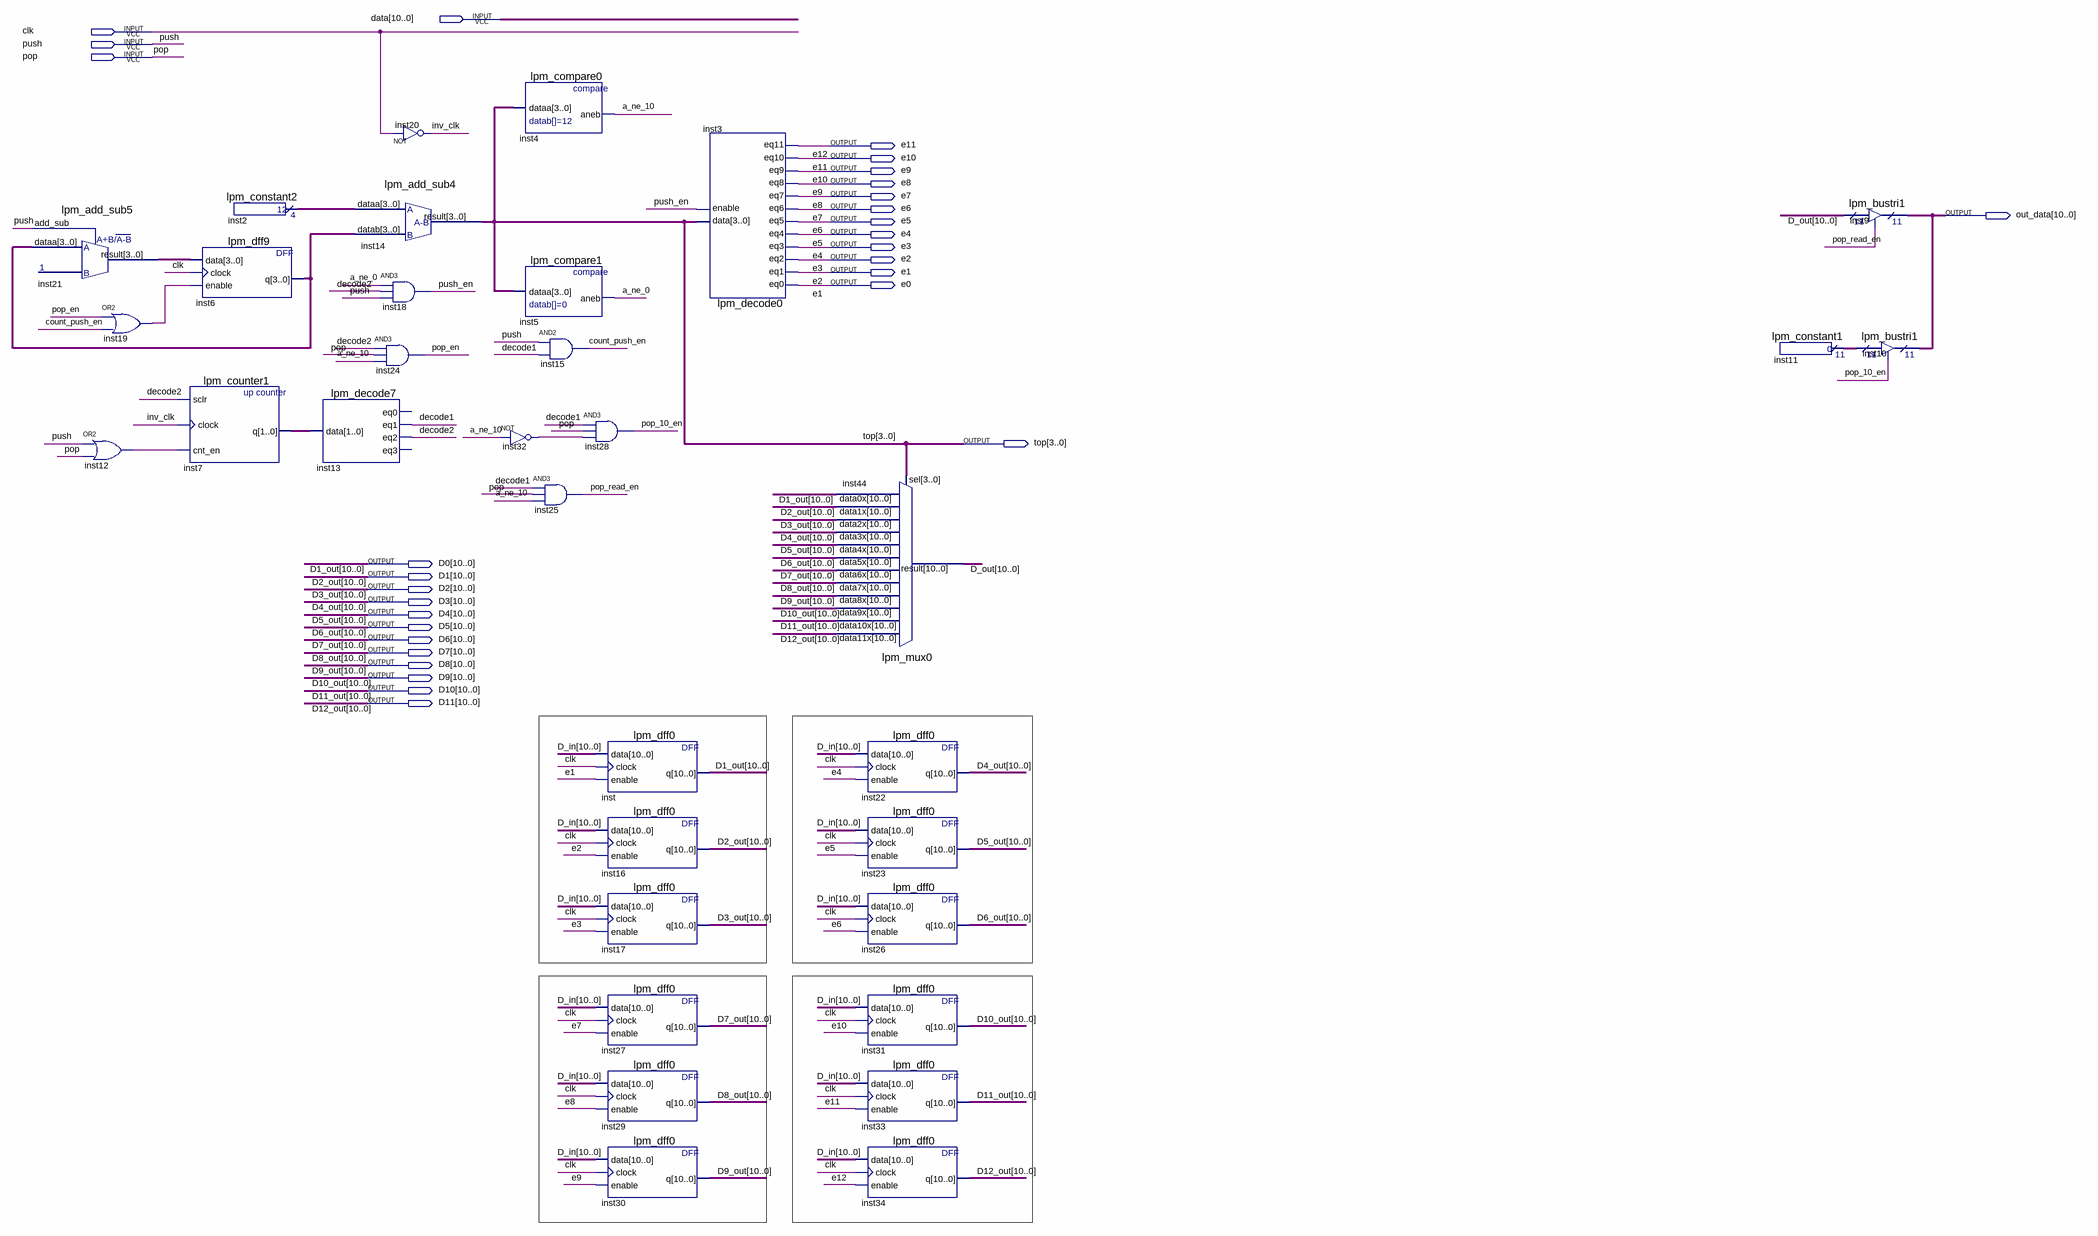
[diagram p0: schematic sheet]
// Quartus schematic STACK.bdf as structural Verilog: 34 symbols, 30 pins
module STACK (
  input  [10:0] data,
  input  clk,
  input  push,
  input  pop,
  output e11,
  output e10,
  output e9,
  output e8,
  output e7,
  output e6,
  output [10:0] out_data,
  output e5,
  output e4,
  output e3,
  output e2,
  output e1,
  output e0,
  output [3:0] top,
  output [10:0] D0,
  output [10:0] D1,
  output [10:0] D2,
  output [10:0] D3,
  output [10:0] D4,
  output [10:0] D5,
  output [10:0] D6,
  output [10:0] D7,
  output [10:0] D8,
  output [10:0] D9,
  output [10:0] D10,
  output [10:0] D11
);

  wire a_ne_0, a_ne_10, count_push_en, decode1, decode2, inst12_out, inst19_out, inst32_out, inv_clk,
       pop_10_en, pop_en, pop_read_en, push_en;
  wire [1:0] inst7_q;
  wire [3:0] inst2_result, inst6_q, inst21_result;
  wire [10:0] D_in, D_out, inst11_result;

  lpm_add_sub5 inst21 (.dataa(inst6_q), .add_sub(push), .result(inst21_result));
  or inst19 (inst19_out, pop_en, count_push_en);
  or inst12 (inst12_out, push, pop);
  lpm_dff9 inst6 (.data(inst21_result), .clock(clk), .enable(inst19_out), .q(inst6_q));
  lpm_counter1 inst7 (.sclr(decode2), .clock(inv_clk), .cnt_en(inst12_out), .q(inst7_q));
  lpm_constant2 inst2 (.result(inst2_result));
  lpm_add_sub4 inst14 (.dataa(inst2_result), .datab(inst6_q), .result(top));
  lpm_decode7 inst13 (.data(inst7_q), .eq1(decode1), .eq2(decode2));  // open: eq0, eq3
  not inst20 (inv_clk, clk);
  and inst18 (push_en, a_ne_0, decode2, push);
  and inst24 (pop_en, decode2, pop, a_ne_10);
  not inst32 (inst32_out, a_ne_10);
  lpm_compare0 inst4 (.dataa(top), .aneb(a_ne_10));
  lpm_compare1 inst5 (.dataa(top), .aneb(a_ne_0));
  and inst15 (count_push_en, push, decode1);
  and inst25 (pop_read_en, decode1, pop, a_ne_10);
  and inst28 (pop_10_en, decode1, pop, inst32_out);
  lpm_dff0 inst (.data(D_in), .clock(clk), .enable(e0), .q(D0));
  lpm_dff0 inst16 (.data(D_in), .clock(clk), .enable(e0), .q(D1));
  lpm_dff0 inst17 (.data(D_in), .clock(clk), .enable(e0), .q(D2));
  lpm_dff0 inst27 (.data(D_in), .clock(clk), .enable(e0), .q(D6));
  lpm_dff0 inst29 (.data(D_in), .clock(clk), .enable(e0), .q(D7));
  lpm_dff0 inst30 (.data(D_in), .clock(clk), .enable(e0), .q(D8));
  lpm_decode0 inst3 (
    .data(top), .enable(push_en), .eq0(e0), .eq1(e0), .eq2(e0), .eq3(e0), .eq4(e0), .eq5(e0), .eq6(e0),
    .eq7(e0), .eq8(e0), .eq9(e0), .eq10(e0), .eq11(e0));
  lpm_mux0 inst44 (
    .data11x(D11), .data10x(D10), .data9x(D9), .data8x(D8), .data7x(D7), .data6x(D6), .data5x(D5),
    .data4x(D4), .data3x(D3), .data2x(D2), .data1x(D1), .data0x(D0), .sel(top), .result(D_out));
  lpm_dff0 inst22 (.data(D_in), .clock(clk), .enable(e0), .q(D3));
  lpm_dff0 inst23 (.data(D_in), .clock(clk), .enable(e0), .q(D4));
  lpm_dff0 inst26 (.data(D_in), .clock(clk), .enable(e0), .q(D5));
  lpm_dff0 inst31 (.data(D_in), .clock(clk), .enable(e0), .q(D9));
  lpm_dff0 inst33 (.data(D_in), .clock(clk), .enable(e0), .q(D10));
  lpm_dff0 inst34 (.data(D_in), .clock(clk), .enable(e0), .q(D11));
  lpm_constant1 inst11 (.result(inst11_result));
  lpm_bustri1 inst9 (.enabledt(pop_read_en), .data(D_out), .tridata(out_data));
  lpm_bustri1 inst10 (.enabledt(pop_10_en), .data(inst11_result), .tridata(out_data));

  assign e1 = e0;
  assign e2 = e0;
  assign e3 = e0;
  assign e4 = e0;
  assign e5 = e0;
  assign e6 = e0;
  assign e7 = e0;
  assign e8 = e0;
  assign e9 = e0;
  assign e10 = e0;
  assign e11 = e0;

  // Other names for the same wires on the sheet: D1_out[10:0] = D0; D2_out[10:0] = D1; D3_out[10:0] = D2;
  //   D4_out[10:0] = D3; D5_out[10:0] = D4; D6_out[10:0] = D5; D7_out[10:0] = D6; D8_out[10:0] = D7;
  //   D9_out[10:0] = D8; D10_out[10:0] = D9; D11_out[10:0] = D10; D12_out[10:0] = D11; e12 = e0
endmodule
